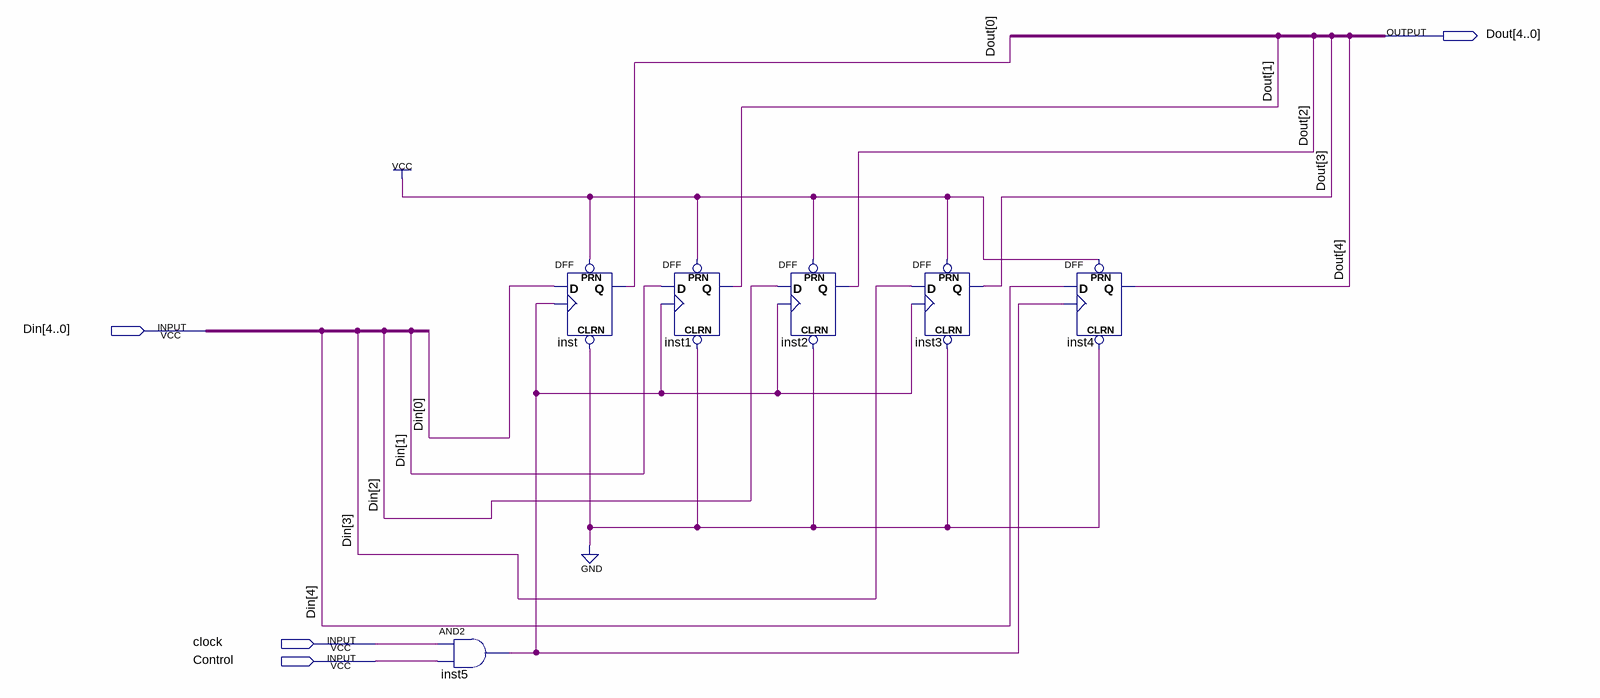
[diagram p0: schematic sheet]
// Quartus schematic reg.bdf as structural Verilog: 6 symbols, 4 pins
module \reg  (
  input  [4:0] Din,
  input  clock,
  input  Control,
  output [4:0] Dout
);

  wire inst5_out;

  and inst5 (inst5_out, clock, Control);
  DFF inst (.CLRN(1'b0), .CLK(inst5_out), .D(Din[0]), .PRN(1'b1), .Q(Dout[0]));
  DFF inst1 (.CLRN(1'b0), .CLK(inst5_out), .D(Din[1]), .PRN(1'b1), .Q(Dout[1]));
  DFF inst2 (.CLRN(1'b0), .CLK(inst5_out), .D(Din[2]), .PRN(1'b1), .Q(Dout[2]));
  DFF inst3 (.CLRN(1'b0), .CLK(inst5_out), .D(Din[3]), .PRN(1'b1), .Q(Dout[3]));
  DFF inst4 (.CLRN(1'b0), .CLK(inst5_out), .D(Din[4]), .PRN(1'b1), .Q(Dout[4]));
endmodule
